# Altium schematic sheet [9] USB.SchDoc
size A
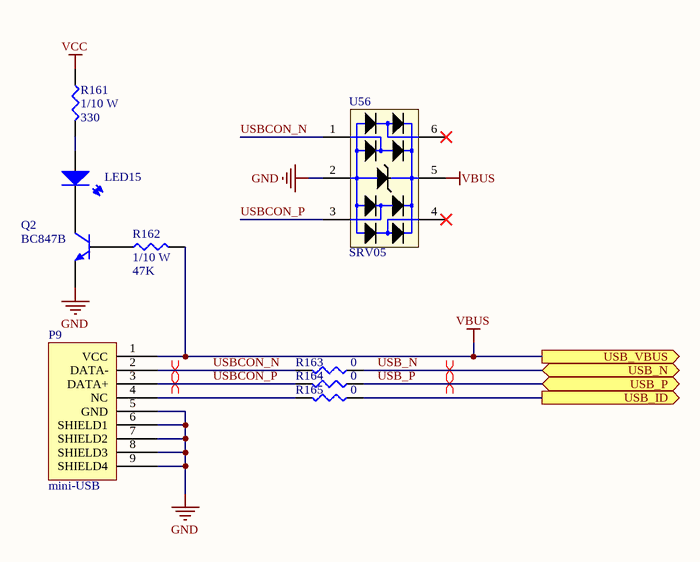
[diagram p0: [9] USB.SchDoc]

## Parts
LED15  LED 0603  [LED 0603]  (value not drawn)
P9  mini-USB  [USB/SM0.8-6H5]
Q2  BC847B  [SOT23]
R161  value 330  Rating: 1/10 W  [RES0805]  (hidden comment: ChipRes 330R 1%)
R162  value 47K  Rating: 1/10 W  [RES0805]  (hidden comment: ChipRes 47K 1%)
R163  value 0  [RES0805]  (hidden comment: ChipRes)
R164  value 0  [RES0805]  (hidden comment: ChipRes)
R165  value 0  [RES0805]  (hidden comment: ChipRes)
U56  SRV05  [SOT23-6]

## Ports
USB_ID (out), USB_N (bidir), USB_P (bidir), USB_VBUS (out)

## Nets
GND: P9.5(GND) P9.6(SHIELD1) P9.7(SHIELD2) P9.8(SHIELD3) P9.9(SHIELD4) Q2.2(E) U56.2
VBUS: P9.1(VCC) R162.2 U56.5 ; port USB_VBUS
VCC: R161.1
USB_ID: R165.1 ; port USB_ID
USB_N: R163.1 ; port USB_N
USB_P: R164.1 ; port USB_P
USBCON_N: P9.2(DATA-) R163.2 U56.1
USBCON_P: P9.3(DATA+) R164.2 U56.3
NetLED15_1: LED15.1 Q2.1(C)
NetLED15_2: LED15.2 R161.2
NetP9_4: P9.4(NC) R165.2
NetQ2_3: Q2.3(B) R162.1

Not connected (* = marked no-connect by the designer): U56 4* 6*

## Layout directives
differential pair: USB_N, USB_P, USBCON_N, USBCON_P

## Library data of the parts
LED15 = LED0603
P9 = miniUSB
Q2 = BC847B: SOT23 NPN Silicon Planar General Purpose Transistor; Published: 8-Jun-2000; LatestRevisionDate: 17-Jul-2002; LatestRevisionNote: Re-released for DXP Platform.; DatasheetVersion: Jan-1997; PackageVersion: 1996; PackageReference: SOT23; Publisher: Altium Limited; PackageDescription: SOT-23; 3 Leads; Body 3.1 x 2.5 mm, inc. leads (LxW max), Alternate Lead Configuration; ComponentLink1Description: Manufacturer Link; ComponentLink1URL: http://www.zetex.com/
R161 = ChipRes 330R 1%: Think Film Chip resistor; Temperature Coefficient: 200ppm/K; Tolerance: 1%; Type: ThickFilm
R162 = ChipRes 47K 1%: Think Film Chip resistor; Temperature Coefficient: 200ppm/K; Tolerance: 1%; Type: ThickFilm
R163-R165 = ChipRes: Chip resistor
U56 = SRV05: Protection 6V 10A